# Altium schematic sheet DC-DC.SchDoc
size A4; SheetNumber: 3; SheetTotal: 7
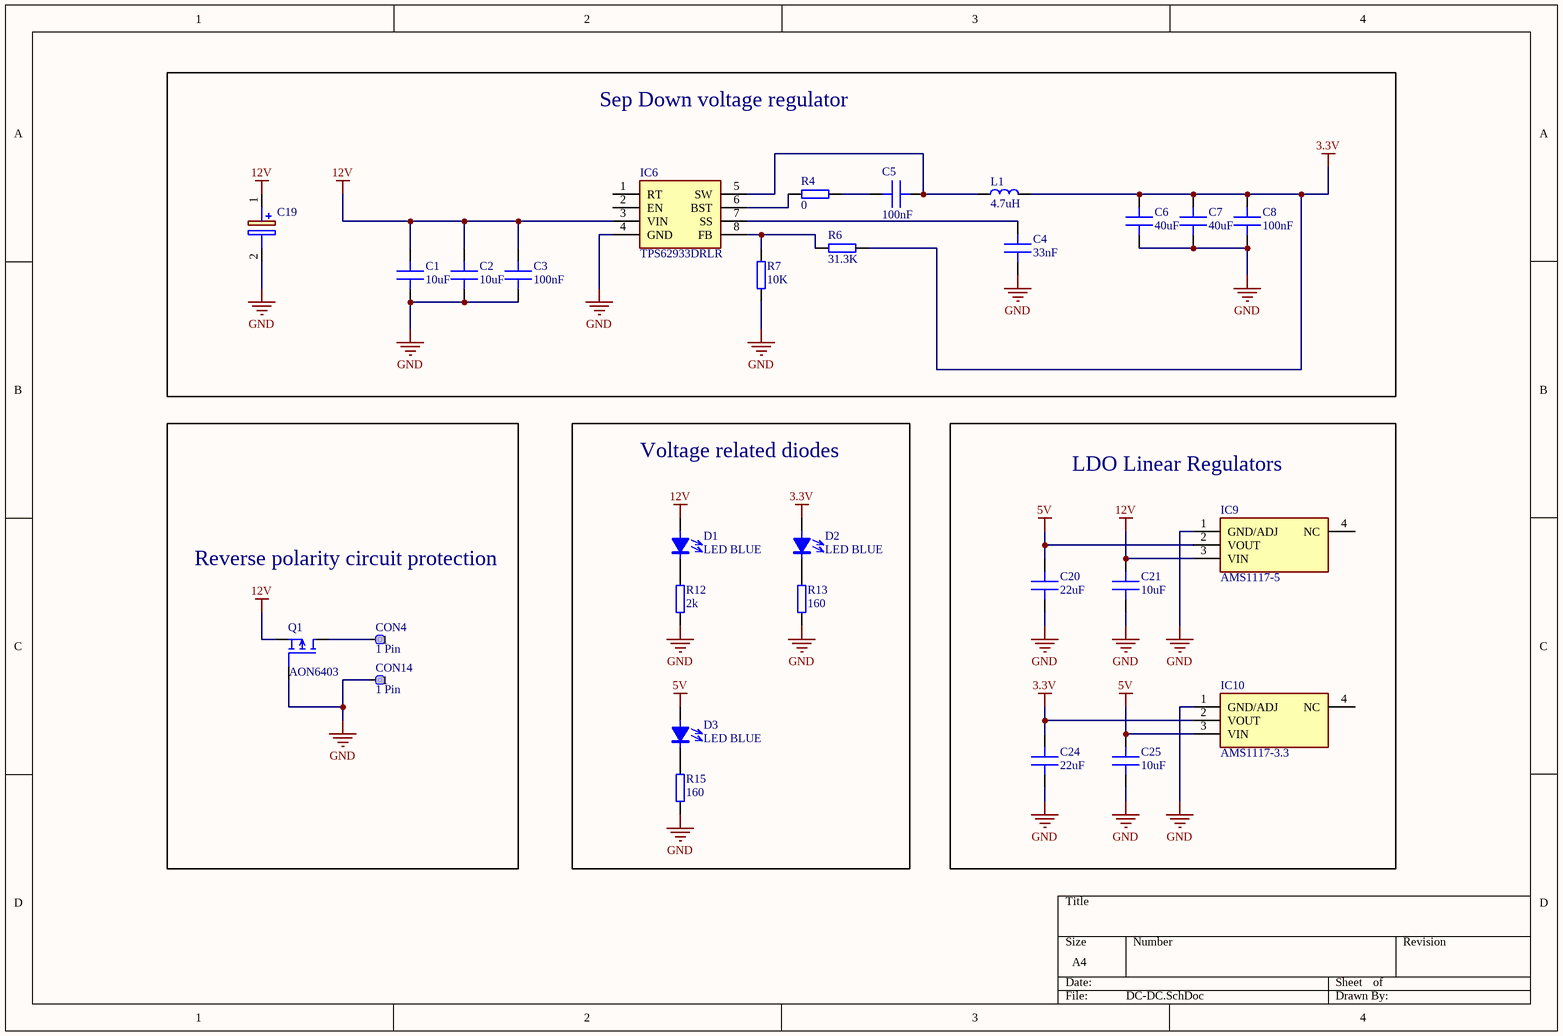
[diagram p0: DC-DC.SchDoc]

## Parts
C1  10uF  [C 1206]
C2  10uF  [C 1206]
C3  100nF  [C 0603]
C4  33nF  [C 0402]
C5  100nF  [C 0402]
C6  40uF  [C 1206]
C7  40uF  [C 1206]
C8  100nF  [C 0603]
C19  UVY1V101MED1TD  [CAPPRD250W50D655H1250]  (value not drawn)
C20  22uF  [C 0805]
C21  10uF  [C 0805]
C24  22uF  [C 0805]
C25  10uF  [C 0805]
CON4  1 Pin  [SMD PAD]
CON14  1 Pin  [SMD PAD]
D1  LED BLUE  [LED 0603 BLUE]
D2  LED BLUE  [LED 0603 BLUE]
D3  LED BLUE  [LED 0603 BLUE]
IC6  TPS62933DRLR  [SOTFL50P160X60-8N]
IC9  AMS1117-5  [SOT229P700X180-4N]
IC10  AMS1117-3.3  [SOT229P700X180-4N]
L1  4.7uH  [HPI0630]
Q1  AON6403  [DFN 5x6]
R4  0  [R 0402]
R6  31.3K  [R 0402]
R7  10K  [R 0402]
R12  2k  [R 0402]
R13  160  [R 0402]
R15  160  [R 0402]

## Blocks framed on the sheet
Sep Down voltage regulator: C1-C8 C19 IC6 L1 R4 R6 R7
Reverse polarity circuit protection: CON4 CON14 Q1
Voltage related diodes: D1-D3 R12 R13 R15
LDO Linear Regulators: C20 C21 C24 C25 IC9 IC10

## Nets
3.3V: C6.1 C7.1 C8.1 C24.1 D2.1 IC10.2(VOUT) L1.2 R6.1
5V: C20.1 C25.1 D3.1 IC9.2(VOUT) IC10.3(VIN)
12V: C1.1 C2.1 C3.1 C19.1(+) C21.1 D1.1 IC6.3(VIN) IC9.3(VIN) Q1.1,_2,_3(S)
GND: C1.2 C2.2 C3.2 C4.2 C6.2 C7.2 C8.2 C19.2(-) C20.2 C21.2 C24.2 C25.2 CON14.1 IC6.4(GND) IC9.1(GND/ADJ) IC10.1(GND/ADJ) Q1.4(G) R7.1 R12.1 R13.1 R15.1
NetC4_1: C4.1 IC6.7(SS)
NetC5_1: C5.1 R4.1
NetC5_2: C5.2 IC6.5(SW) L1.1
NetCON4_1: CON4.1 Q1.5_8(D)
NetD1_2: D1.2 R12.2
NetD2_2: D2.2 R13.2
NetD3_2: D3.2 R15.2
NetIC6_6: IC6.6(BST) R4.2
NetIC6_8: IC6.8(FB) R6.2 R7.2

Not connected (* = marked no-connect by the designer): IC6 1(RT) 2(EN); IC9 4(NC); IC10 4(NC)

## Library data of the parts
C1-C8 C20 C21 C24 C25 = Capacitor: MLCC Capacitor
C19 = UVY1V101MED1TD: Capacitor Polarised; Manufacturer_Name: Nichicon; Datasheet Link: http://nichicon-us.com/english/products/pdfs/e-uvy.pdf; Height: 12.5mm; Manufacturer_Part_Number: UVY1V101MED1TD; Arrow Part Number: UVY1V101MED1TD; Arrow Price/Stock: https://www.arrow.com/en/products/uvy1v101med1td/nichicon
IC6 = TPS62933DRLR: Integrated Circuit; Manufacturer_Name: Texas Instruments; Datasheet Link: https://www.ti.com/lit/ds/symlink/tps62933.pdf?ts=1626073394234; Height: 0.6mm; Manufacturer_Part_Number: TPS62933DRLR; Mouser Part Number: 595-TPS62933DRLR; Mouser Price/Stock: https://www.mouser.co.uk/ProductDetail/Texas-Instruments/TPS62933DRLR?qs=Rp5uXu7WBW9fv47wfQVntQ%3D%3D; Arrow Part Number: TPS62933DRLR; Arrow Price/Stock: https://www.arrow.com/en/products/tps62933drlr/texas-instruments?utm_currency=USD&region=nac
IC9 IC10 = AMS1117-3.3: Integrated Circuit; Manufacturer_Name: Advanced; Datasheet Link: https://datasheet.datasheetarchive.com/originals/distributors/Datasheets-28/DSA-550594.pdf; Height: 1.8mm; Manufacturer_Part_Number: AMS1117-3.3
L1 = Inductor: General pourpouse inductor
Q1 = AON6403: P-Mosfet 30V 67A Rds(on) 3.1mR
R4 R6 R7 R12 R13 R15 = Resistor: General pourpouse resistor